# Altium schematic sheet MagcontactNRF.SchDoc
size A4
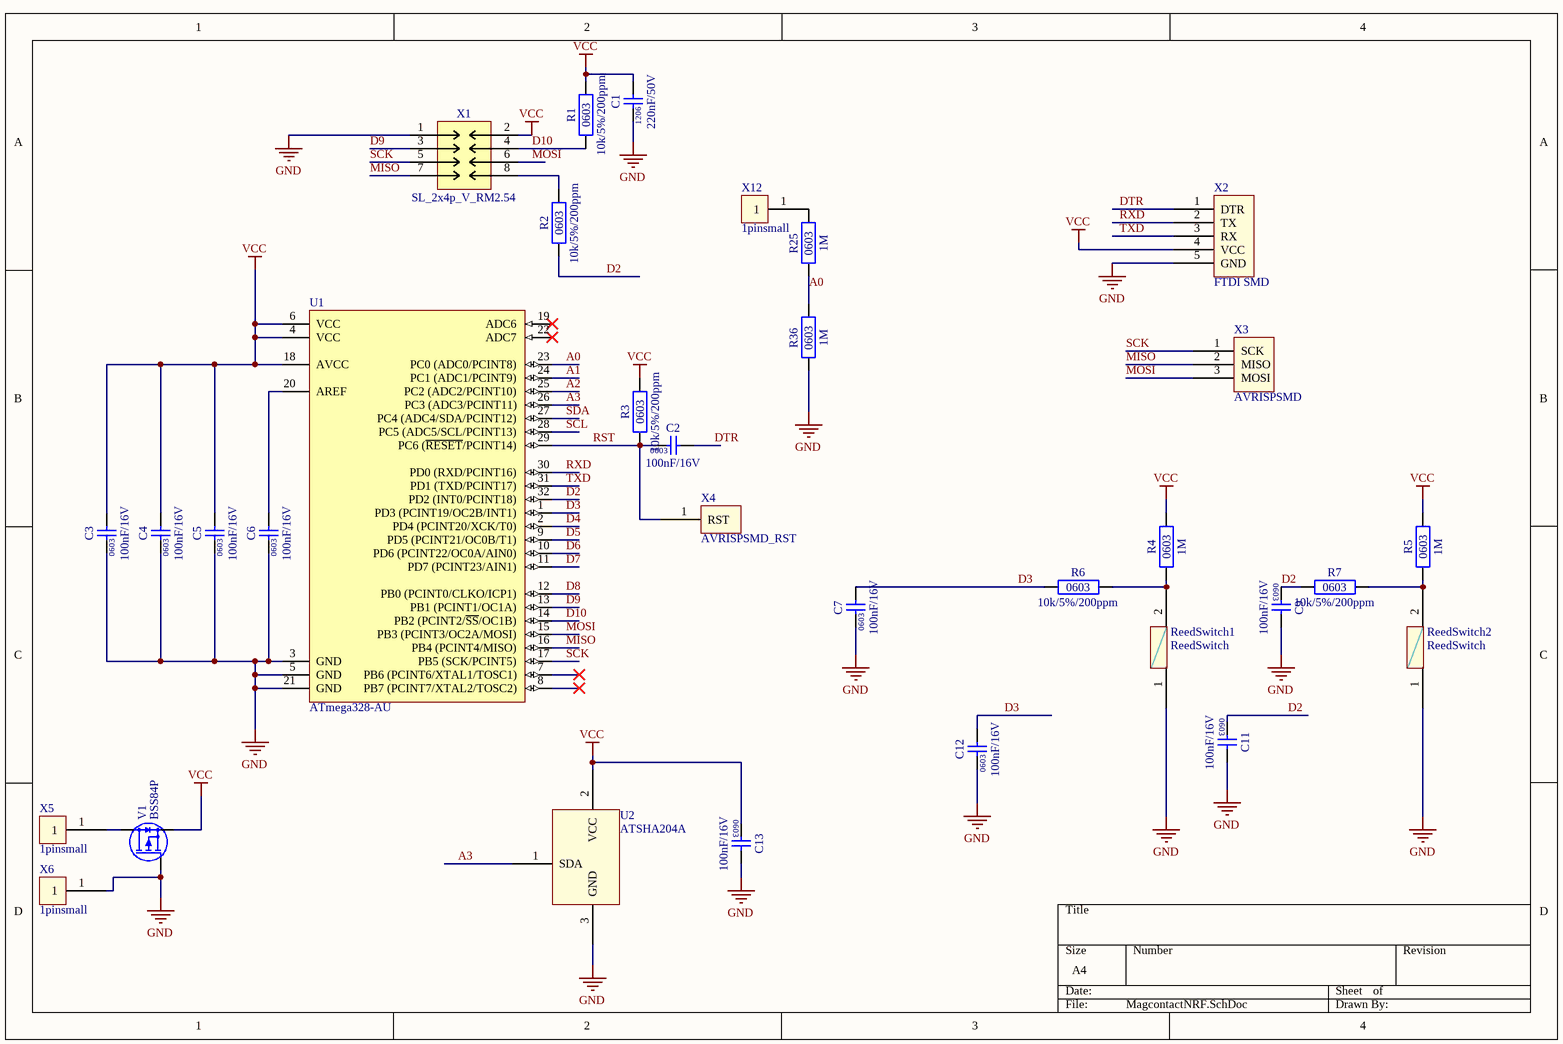
[diagram p0: MagcontactNRF.SchDoc]

## Parts
C1  220nF/50V  [CAP_1206_IPC_B]
C2  100nF/16V  [CAP_0603_IPC_B]
C3  100nF/16V  [CAP_0603_IPC_B]
C4  100nF/16V  [CAP_0603_IPC_B]
C5  100nF/16V  [CAP_0603_IPC_B]
C6  100nF/16V  [CAP_0603_IPC_B]
C7  100nF/16V  [CAP_0603_IPC_B]
C9  100nF/16V  [CAP_0603_IPC_B]
C11  100nF/16V  [CAP_0603_IPC_B]
C12  100nF/16V  [CAP_0603_IPC_B]
C13  100nF/16V  [CAP_0603_IPC_B]
R1  10k/5%/200ppm  [RES_0603_IPC_B]
R2  10k/5%/200ppm  [RES_0603_IPC_B]
R3  10k/5%/200ppm  [RES_0603_IPC_B]
R4  1M  [RES_0603_IPC_B]
R5  1M  [RES_0603_IPC_B]
R6  10k/5%/200ppm  [RES_0603_IPC_B]
R7  10k/5%/200ppm  [RES_0603_IPC_B]
R25  1M  [RES_0603_IPC_B]
R36  1M  [RES_0603_IPC_B]
ReedSwitch1  ReedSwitch  [MDSM-4]
ReedSwitch2  ReedSwitch  [MDSM-4]
U1  ATmega328-AU  [32A_N]
U2  ATSHA204A  [SOT23-3L]
V1  BSS84P  [SOT23-3L]
X1  SL_2x4p_V_RM2.54  [HEADER2X4_V_RM2.54]
X2  FTDI SMD  [FTDI SMD]
X3  AVRISPSMD  [AVRISPSMD]
X4  AVRISPSMD_RST  [AVRISPSMD - RST]
X5  1pinsmall  [1pinsmall]
X6  1pinsmall  [1pinsmall]
X12  1pinsmall  [1pinsmall]

## Nets
GND: C1.1 C3.1 C4.1 C5.1 C6.1 C7.1 C9.2 C11.2 C12.1 C13.2 R36.1 ReedSwitch1.1 ReedSwitch2.1 U1.3(GND) U1.5(GND) U1.21(GND) U2.3(GND) V1.G X1.1 X2.5(GND) X6.1
VCC: C1.2 C3.2 C4.2 C5.2 C13.1 R1.2 R3.2 R4.2 R5.2 U1.4(VCC) U1.6(VCC) U1.18(AVCC) U2.2(VCC) V1.S X1.2 X2.4(VCC)
A0: R25.1 R36.2 U1.23(PC0_(ADC0/PCINT8))
A1: U1.24(PC1_(ADC1/PCINT9))
A2: U1.25(PC2_(ADC2/PCINT10))
A3: U1.26(PC3_(ADC3/PCINT11)) U2.1(SDA)
D2: C9.1 C11.1 R2.1 R7.1 U1.32(PD2_(INT0/PCINT18))
D3: C7.2 C12.2 R6.1 U1.1(PD3_(PCINT19/OC2B/INT1))
D4: U1.2(PD4_(PCINT20/XCK/T0))
D5: U1.9(PD5_(PCINT21/OC0B/T1))
D6: U1.10(PD6_(PCINT22/OC0A/AIN0))
D7: U1.11(PD7_(PCINT23/AIN1))
D8: U1.12(PB0_(PCINT0/CLKO/ICP1))
D9: U1.13(PB1_(PCINT1/OC1A)) X1.3
D10: R1.1 U1.14(PB2_(PCINT2/~{SS}/OC1B)) X1.4
DTR: C2.2 X2.1(DTR)
MISO: U1.16(PB4_(PCINT4/MISO)) X1.7 X3.2(MISO)
MOSI: U1.15(PB3_(PCINT3/OC2A/MOSI)) X1.6 X3.3(MOSI)
RST: C2.1 R3.1 U1.29(PC6_(~{RESET}/PCINT14)) X4.1(RST)
RXD: U1.30(PD0_(RXD/PCINT16)) X2.2(TX)
SCK: U1.17(PB5_(SCK/PCINT5)) X1.5 X3.1(SCK)
SCL: U1.28(PC5_(ADC5/SCL/PCINT13))
SDA: U1.27(PC4_(ADC4/SDA/PCINT12))
TXD: U1.31(PD1_(TXD/PCINT17)) X2.3(RX)
NetC6_2: C6.2 U1.20(AREF)
NetR2_2: R2.2 X1.8
NetR4_1: R4.1 R6.2 ReedSwitch1.2
NetR5_1: R5.1 R7.2 ReedSwitch2.2
NetR25_2: R25.2 X12.1
NetV1_D: V1.D X5.1

Not connected (* = marked no-connect by the designer): U1 7(PB6_(PCINT6/XTAL1/TOSC1))* 8(PB7_(PCINT7/XTAL2/TOSC2))* 19(ADC6)* 22(ADC7)*

## Notes on the sheet
- (in symbol 1M_0603_01-0898) 0603
- (in symbol 10k_0603_01-0424) 0603
- (in symbol 100nF_16V_0603_02-0338) 0603
- (in symbol 220nF_50V_1206_02-0087) 1206

## Library data of the parts
C1 = 220nF_50V_1206_02-0087: 02-0087 - SMD Capacitor 1206 220nF 50V X7R; PcbLib: Capacitors SMT.PcbLib; Toleranz: 20%; Prüfstatus: geprüft; EX-relevant: EX; FuSi-relevant: FuSi; Published: 21.09.2010; Publisher: RB; PackageDescription: Capacitor SMD 1206; Partnumber: 02-0087; HelpURL: K:\Solutions\ETW\Projekte\Bibliotheken\Bauteil-Neuanlagen\Datenblätter\02er-Parts\YAGEO_Chip_Capacitors.pdf; Spannung: 50V; Typ/Material: X7R; Value: 220nF
C2-C7 C9 C11-C13 = 100nF_16V_0603_02-0338: 02-0338 - SMD Capacitor 0603 100nF 16V X7R; PcbLib: Capacitors SMT.PcbLib; Toleranz: 10%; Prüfstatus: geprüft; EX-relevant: EX; FuSi-relevant: FuSi; HelpURL: K:\Solutions\ETW\Projekte\Bibliotheken\Bauteil-Neuanlagen\Datenblätter\02er-Parts\; Partnumber: 02-0338; Publisher: DD; Published: 02.12.2010; PackageDescription: SMD Capacitor 0603; Spannung: 16V; Typ/Material: X7R; Value: 100nF
R1-R3 R6 R7 = 10k_0603_01-0424: 01-0424 - SMD Resistor 0603 0.063W 5%; PcbLib: Resistors SMT.PcbLib; TCR: 200ppm; Prüfstatus: geprüft; Value: 10k; EX-relevant: EX; FuSi-relevant: FuSi; Partnumber: 01-0424; HelpURL: N:\data\Solutions\etw\Projekte\Bibliotheken\Bauteil-Neuanlagen\Datenblätter\01er-Parts\Yageo_Chip_Resistors_0603.pdf; Publisher: RB; Published: 100927; PackageDescription: SMD Resistor 0603; LatestRevisionNote: *; LatestRevisionDate: *; Leistung: 0.063W; Toleranz: 5%
R4 R5 R25 R36 = 1M_0603_01-0898: 01-0898 - SMD Resistor 0603  0.1W  1%; PcbLib: Resistors SMT.PcbLib; TCR: 100ppm; Prüfstatus: geprüft; EX-relevant: EX; FuSi-relevant: FuSi; Partnumber: 01-0898; Publisher: DG; Published: 22.05.2012; PackageDescription: SMD Resistor 0603; LatestRevisionNote: *; LatestRevisionDate: *; Leistung: 0.1W; Toleranz: 1%; Value: 1M
U1 = ATmega328-AU: 8-bit AVR Microcontroller, 32KB Flash, 1KB EEPROM, 2KB SRAM, 32-pin TQFP, Industrial Grade (-40°C to 85°C); Published: 1-Apr-2010; DatasheetVersion: revA, Jan-2010; PackageVersion: revB, Oct-2001; PackageReference: 32A; Publisher: Altium Limited; PackageDescription: 32-Lead, 7x7x1.0 mm Body, 0.8mm Lead Pitch, Thin Profile Plastic Quad Flat Package (TQFP); Supplier 1: Digi-Key; Supplier Part Number 1: ATMEGA328-AU-ND; Supplier 2: Mouser; Supplier Part Number 2: 556-ATMEGA328-AU; Code_JEDEC: MS-026-ABA; ComponentLink1Description: Manufacturer Link; ComponentLink1URL: http://www.atmel.com/products/avr/default.asp?; ComponentLink2Description: ATmega48A/48PA/88A/88PA/168A/168PA/328/328P Datasheet; ComponentLink2URL: http://www.atmel.com/dyn/resources/prod_documents/8271.pdf; ComponentLink3Description: ATmega48A/48PA/88A/88PA/168A/168PA/328/328P Summary; ComponentLink3URL: http://www.atmel.com/dyn/resources/prod_documents/8271S.pdf; ComponentLink4Description: Atmel.com Home; ComponentLink4URL: http://www.atmel.com
V1 = M_BSS84_08-0275: 08-0275 - SIPMOS Small-Signal-Transistor; pin to pad: D>3 G>1 S>2; PcbLib: SOT, IPC-SM-782.PcbLib; Prüfstatus: geprüft; HelpURL: N:\data\Solutions\etw\Projekte\Bibliotheken\Bauteil-Neuanlagen\Datenblätter\08er-Parts\BSS84P_Rev2.6.pdf; Partnumber: 08-0275; LatestRevisionDate: *; LatestRevisionNote: *; Publisher: MM; Published: 22.06.2011; PackageDescription: SOT23
X1 = SL_2x4p_V_RM2.54_03-0086: NRF; PcbLib: Connectors - Headers Generic.PcbLib; Prüfstatus: geprüft; Partnumber: 03-0086; Publisher: RB; Published: 30.03.2010; PackageDescription: RM2.54; LatestRevisionDate: *; LatestRevisionNote: *; HelpURL: N:\data\Solutions\etw\Projekte\Bibliotheken\Bauteil-Neuanlagen\Datenblätter\03er-Parts\Pin Header Strips - Pitch 2,54 mm - Straight.pdf